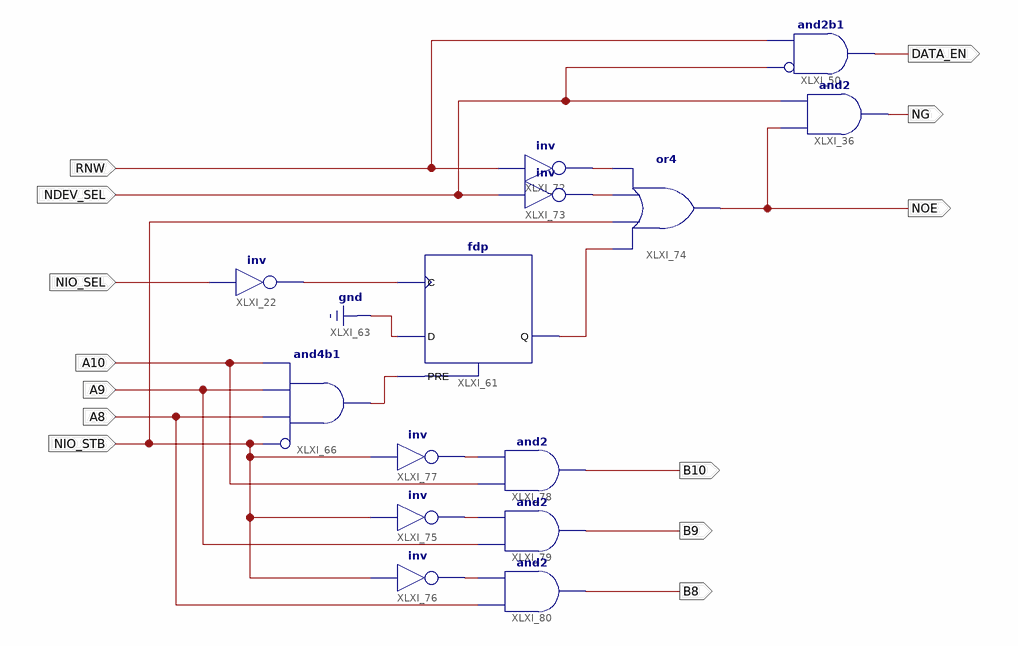
[diagram p0: schematic sheet 1]
// Xilinx ISE schematic AddressDecoder.sch (xc9500xl) as structural Verilog: 14 symbols, 13 ports
module AddressDecoder (
  input  A10,
  input  A9,
  input  A8,
  input  NIO_SEL,
  input  NDEV_SEL,
  input  RNW,
  input  NIO_STB,
  output B10,
  output B9,
  output B8,
  output NOE,
  output NG,
  output DATA_EN
);

  wire XLXN_10, XLXN_46, XLXN_110, XLXN_116, XLXN_117, XLXN_118, XLXN_119, XLXN_120;

  and XLXI_36 (NG, NOE, NDEV_SEL);
  and XLXI_50 (DATA_EN, ~NDEV_SEL, RNW);  // and2b1
  not XLXI_22 (XLXN_46, NIO_SEL);
  fdp XLXI_61 (.C(XLXN_46), .D(1'b0), .PRE(XLXN_10), .Q(XLXN_110));
  and XLXI_66 (XLXN_10, ~NIO_STB, A8, A9, A10);  // and4b1
  not XLXI_72 (XLXN_116, RNW);
  not XLXI_73 (XLXN_117, NDEV_SEL);
  or XLXI_74 (NOE, XLXN_110, NIO_STB, XLXN_117, XLXN_116);
  not XLXI_75 (XLXN_119, NIO_STB);
  not XLXI_76 (XLXN_120, NIO_STB);
  not XLXI_77 (XLXN_118, NIO_STB);
  and XLXI_78 (B10, A10, XLXN_118);
  and XLXI_79 (B9, A9, XLXN_119);
  and XLXI_80 (B8, A8, XLXN_120);
endmodule
